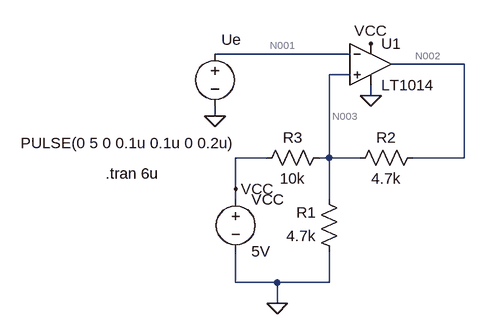
[diagram p0: schematic aufgabe4_schmitt_trigger.asc]
aufgabe4_schmitt_trigger.asc, the LTspice schematic file:
Version 4
SHEET 1 880 680
WIRE 224 160 16 160
WIRE 400 176 288 176
WIRE 224 192 192 192
WIRE 256 224 256 208
WIRE 16 256 16 240
WIRE 96 320 48 320
WIRE 192 320 192 192
WIRE 192 320 176 320
WIRE 240 320 192 320
WIRE 400 320 400 176
WIRE 400 320 320 320
WIRE 48 368 48 320
WIRE 48 384 48 368
WIRE 192 384 192 320
WIRE 48 512 48 464
WIRE 112 512 48 512
WIRE 192 512 192 464
WIRE 192 512 112 512
WIRE 112 544 112 512
FLAG 16 256 0
FLAG 256 224 0
FLAG 112 544 0
FLAG 48 368 VCC
FLAG 256 144 VCC
SYMBOL Opamps\\LT1014 256 112 R0
SYMATTR InstName U1
SYMBOL voltage 16 144 R0
WINDOW 0 10 -6 Left 2
WINDOW 3 -299 153 Left 2
WINDOW 123 0 0 Left 2
WINDOW 39 0 0 Left 2
SYMATTR InstName Ue
SYMATTR Value PULSE(0 5 0 0.1u 0.1u 0 0.2u)
SYMBOL voltage 48 368 R0
WINDOW 123 0 0 Left 2
WINDOW 39 0 0 Left 2
SYMATTR InstName VCC
SYMATTR Value 5V
SYMBOL res 192 304 R90
WINDOW 0 0 56 VBottom 2
WINDOW 3 32 56 VTop 2
SYMATTR InstName R3
SYMATTR Value 10k
SYMBOL res 336 304 R90
WINDOW 0 0 56 VBottom 2
WINDOW 3 32 56 VTop 2
SYMATTR InstName R2
SYMATTR Value 4.7k
SYMBOL res 208 480 R180
WINDOW 0 36 76 Left 2
WINDOW 3 36 40 Left 2
SYMATTR InstName R1
SYMATTR Value 4.7k
TEXT -152 344 Left 2 !.tran 6u

The netlist it stands for:
* aufgabe4_schmitt_trigger.asc
XU1 N003 N001 VCC 0 N002 LT1014  ; pins In+ In- V+ V- OUT
V§Ue N001 0 PULSE(0 5 0 0.1u 0.1u 0 0.2u)
VCC VCC 0 5V
R3 N003 VCC 10k
R2 N002 N003 4.7k
R1 0 N003 4.7k
.tran 6u
.backanno
.end

* Results of the author's LTspice run, read from the files saved beside the schematic
* Operating Point, zero values left out:
*   V(n001) = 2.5 V
*   V(n003) = 963 mV
*   V(vcc) = 5 V
*   V(n002) = 28.46 mV
*   I(R1) = -204.9 µA
*   I(R2) = -198.8 µA
*   I(R3) = -403.7 µA
*   I(Vcc) = -481.2 µA
*   I(Ue) = 8.47 nA
*   Ix(u1:1) = -15.69 nA
*   Ix(u1:2) = -8.47 nA
*   Ix(u1:3) = 77.51 µA
*   Ix(u1:4) = -266.7 µA
*   Ix(u1:5) = 198.8 µA
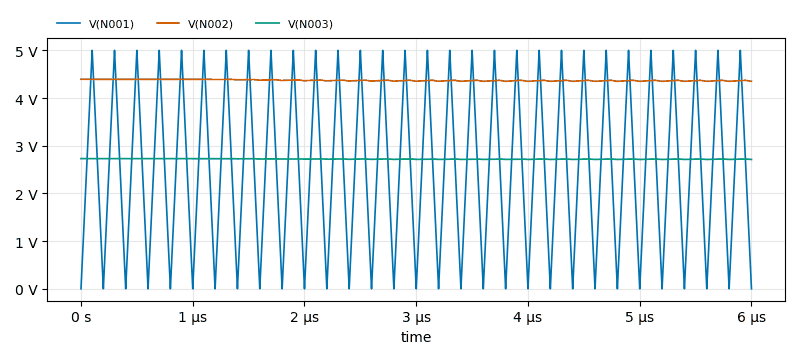
[diagram p1: Transient Analysis of aufgabe4_schmitt_trigger.asc, plotted from the saved traces]
* Transient Analysis, 1 run:
*   V(N001): min 0 V, max 5 V, average 2.5 V, rms 3.055 V, last 0 V
*   V(N002): min 4.351 V, max 4.393 V, average 4.372 V, rms 4.372 V, last 4.351 V
*   V(N003): min 2.713 V, max 2.73 V, average 2.721 V, rms 2.721 V, last 2.713 V